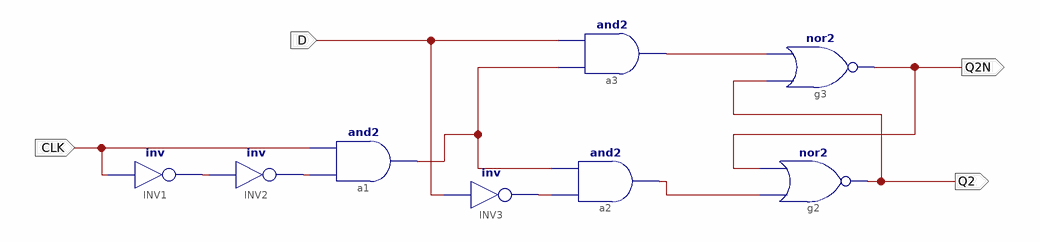
[diagram p0: schematic sheet 1]
// Xilinx ISE schematic SamiFronteSalita.sch (spartan3e) as structural Verilog: 8 symbols, 4 ports
module SamiFronteSalita (
  input  D,
  input  CLK,
  output Q2N,
  output Q2
);

  wire Q, Q1, XLXN_5, XLXN_42, XLXN_68, XLXN_69;

  and a3 (Q, XLXN_42, D);
  and a2 (Q1, XLXN_5, XLXN_42);
  nor g3 (Q2N, Q2, Q);
  nor g2 (Q2, Q1, Q2N);
  not INV3 (XLXN_5, D);
  not INV1 (XLXN_68, CLK);
  and a1 (XLXN_42, XLXN_69, CLK);
  not INV2 (XLXN_69, XLXN_68);
endmodule
